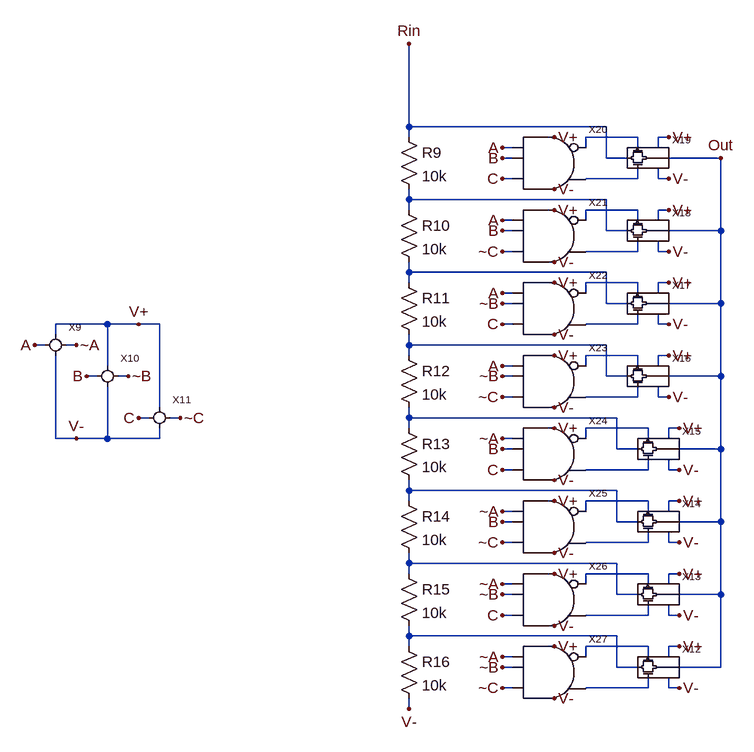
[diagram p0: schematic DAC.asc]
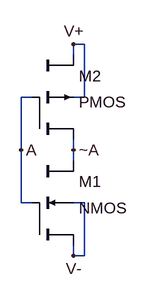
[diagram p1: sub-circuit inverter.asc]
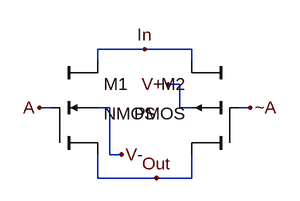
[diagram p2: sub-circuit passgate.asc]
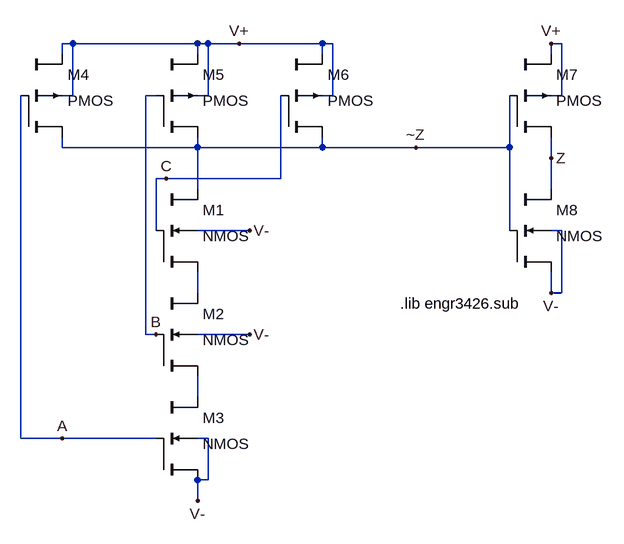
[diagram p3: sub-circuit 3-n-and.asc]
DAC.asc, the LTspice schematic file:
Version 4
SHEET 1 1852 808
WIRE 80 -832 80 -960
WIRE 384 -832 80 -832
WIRE 80 -816 80 -832
WIRE 304 -816 288 -816
WIRE 432 -816 352 -816
WIRE 480 -816 464 -816
WIRE 240 -800 224 -800
WIRE 352 -800 352 -816
WIRE 432 -800 432 -816
WIRE 464 -800 464 -816
WIRE 240 -784 224 -784
WIRE 384 -784 384 -832
WIRE 416 -784 384 -784
WIRE 560 -784 480 -784
WIRE 240 -752 224 -752
WIRE 432 -752 432 -768
WIRE 432 -752 352 -752
WIRE 464 -752 464 -768
WIRE 480 -752 464 -752
WIRE 304 -736 288 -736
WIRE 80 -720 80 -736
WIRE 384 -720 80 -720
WIRE 80 -704 80 -720
WIRE 304 -704 288 -704
WIRE 432 -704 352 -704
WIRE 480 -704 464 -704
WIRE 240 -688 224 -688
WIRE 352 -688 352 -704
WIRE 432 -688 432 -704
WIRE 464 -688 464 -704
WIRE 240 -672 224 -672
WIRE 384 -672 384 -720
WIRE 416 -672 384 -672
WIRE 560 -672 560 -784
WIRE 560 -672 480 -672
WIRE 240 -640 224 -640
WIRE 432 -640 432 -656
WIRE 432 -640 352 -640
WIRE 464 -640 464 -656
WIRE 480 -640 464 -640
WIRE 304 -624 288 -624
WIRE 80 -608 80 -624
WIRE 384 -608 80 -608
WIRE 80 -592 80 -608
WIRE 304 -592 288 -592
WIRE 432 -592 352 -592
WIRE 480 -592 464 -592
WIRE 240 -576 224 -576
WIRE 352 -576 352 -592
WIRE 432 -576 432 -592
WIRE 464 -576 464 -592
WIRE 240 -560 224 -560
WIRE 384 -560 384 -608
WIRE 416 -560 384 -560
WIRE 560 -560 560 -672
WIRE 560 -560 480 -560
WIRE -384 -528 -464 -528
WIRE -336 -528 -384 -528
WIRE -304 -528 -336 -528
WIRE 240 -528 224 -528
WIRE 432 -528 432 -544
WIRE 432 -528 352 -528
WIRE 464 -528 464 -544
WIRE 480 -528 464 -528
WIRE -464 -512 -464 -528
WIRE 304 -512 288 -512
WIRE -480 -496 -496 -496
WIRE -432 -496 -448 -496
WIRE 80 -496 80 -512
WIRE 384 -496 80 -496
WIRE 80 -480 80 -496
WIRE 304 -480 288 -480
WIRE 432 -480 352 -480
WIRE 480 -480 464 -480
WIRE -384 -464 -384 -528
WIRE 240 -464 224 -464
WIRE 352 -464 352 -480
WIRE 432 -464 432 -480
WIRE 464 -464 464 -480
WIRE -400 -448 -416 -448
WIRE -352 -448 -368 -448
WIRE 240 -448 224 -448
WIRE 384 -448 384 -496
WIRE 416 -448 384 -448
WIRE 560 -448 560 -560
WIRE 560 -448 480 -448
WIRE 240 -416 224 -416
WIRE 432 -416 432 -432
WIRE 432 -416 352 -416
WIRE 464 -416 464 -432
WIRE 480 -416 464 -416
WIRE -304 -400 -304 -528
WIRE 304 -400 288 -400
WIRE -320 -384 -336 -384
WIRE -272 -384 -288 -384
WIRE 80 -384 80 -400
WIRE 400 -384 80 -384
WIRE 80 -368 80 -384
WIRE 304 -368 288 -368
WIRE 448 -368 352 -368
WIRE 496 -368 480 -368
WIRE -464 -352 -464 -480
WIRE -432 -352 -464 -352
WIRE -384 -352 -384 -432
WIRE -384 -352 -432 -352
WIRE -304 -352 -304 -368
WIRE -304 -352 -384 -352
WIRE 240 -352 224 -352
WIRE 352 -352 352 -368
WIRE 448 -352 448 -368
WIRE 480 -352 480 -368
WIRE 240 -336 224 -336
WIRE 400 -336 400 -384
WIRE 432 -336 400 -336
WIRE 560 -336 560 -448
WIRE 560 -336 496 -336
WIRE 240 -304 224 -304
WIRE 448 -304 448 -320
WIRE 448 -304 352 -304
WIRE 480 -304 480 -320
WIRE 496 -304 480 -304
WIRE 304 -288 288 -288
WIRE 80 -272 80 -288
WIRE 400 -272 80 -272
WIRE 80 -256 80 -272
WIRE 304 -256 288 -256
WIRE 448 -256 352 -256
WIRE 496 -256 480 -256
WIRE 240 -240 224 -240
WIRE 352 -240 352 -256
WIRE 448 -240 448 -256
WIRE 480 -240 480 -256
WIRE 240 -224 224 -224
WIRE 400 -224 400 -272
WIRE 432 -224 400 -224
WIRE 560 -224 560 -336
WIRE 560 -224 496 -224
WIRE 240 -192 224 -192
WIRE 448 -192 448 -208
WIRE 448 -192 352 -192
WIRE 480 -192 480 -208
WIRE 496 -192 480 -192
WIRE 304 -176 288 -176
WIRE 80 -160 80 -176
WIRE 400 -160 80 -160
WIRE 80 -144 80 -160
WIRE 304 -144 288 -144
WIRE 448 -144 352 -144
WIRE 496 -144 480 -144
WIRE 240 -128 224 -128
WIRE 352 -128 352 -144
WIRE 448 -128 448 -144
WIRE 480 -128 480 -144
WIRE 240 -112 224 -112
WIRE 400 -112 400 -160
WIRE 432 -112 400 -112
WIRE 560 -112 560 -224
WIRE 560 -112 496 -112
WIRE 240 -80 224 -80
WIRE 448 -80 448 -96
WIRE 448 -80 352 -80
WIRE 480 -80 480 -96
WIRE 496 -80 480 -80
WIRE 304 -64 288 -64
WIRE 80 -48 80 -64
WIRE 400 -48 80 -48
WIRE 80 -32 80 -48
WIRE 304 -32 288 -32
WIRE 448 -32 352 -32
WIRE 496 -32 480 -32
WIRE 240 -16 224 -16
WIRE 352 -16 352 -32
WIRE 448 -16 448 -32
WIRE 480 -16 480 -32
WIRE 240 0 224 0
WIRE 400 0 400 -48
WIRE 432 0 400 0
WIRE 560 0 560 -112
WIRE 560 0 496 0
WIRE 240 32 224 32
WIRE 448 32 448 16
WIRE 448 32 352 32
WIRE 480 32 480 16
WIRE 496 32 480 32
WIRE 304 48 288 48
WIRE 80 64 80 48
FLAG 80 64 V-
FLAG 80 -960 Rin
FLAG 224 -800 A
FLAG 224 -688 A
FLAG 224 -576 A
FLAG 224 -464 A
FLAG 224 -352 ~A
FLAG 224 -240 ~A
FLAG 224 -128 ~A
FLAG 224 -16 ~A
FLAG 224 -784 B
FLAG 224 -672 B
FLAG 224 -336 B
FLAG 224 -224 B
FLAG 224 -560 ~B
FLAG 224 -448 ~B
FLAG 224 -112 ~B
FLAG 224 0 ~B
FLAG 224 -752 C
FLAG 224 -528 C
FLAG 224 -304 C
FLAG 224 -80 C
FLAG 224 -640 ~C
FLAG 224 -416 ~C
FLAG 224 -192 ~C
FLAG 224 32 ~C
FLAG -496 -496 A
FLAG -432 -496 ~A
FLAG -416 -448 B
FLAG -352 -448 ~B
FLAG -336 -384 C
FLAG -272 -384 ~C
FLAG -336 -528 V+
FLAG -432 -352 V-
FLAG 496 -32 V+
FLAG 496 32 V-
FLAG 496 -144 V+
FLAG 496 -80 V-
FLAG 496 -256 V+
FLAG 496 -192 V-
FLAG 496 -368 V+
FLAG 496 -304 V-
FLAG 480 -480 V+
FLAG 480 -416 V-
FLAG 480 -592 V+
FLAG 480 -528 V-
FLAG 480 -704 V+
FLAG 480 -640 V-
FLAG 480 -816 V+
FLAG 480 -752 V-
FLAG 304 -816 V+
FLAG 304 -704 V+
FLAG 304 -592 V+
FLAG 304 -480 V+
FLAG 304 -368 V+
FLAG 304 -256 V+
FLAG 304 -144 V+
FLAG 304 -32 V+
FLAG 304 48 V-
FLAG 304 -64 V-
FLAG 304 -176 V-
FLAG 304 -288 V-
FLAG 304 -400 V-
FLAG 304 -512 V-
FLAG 304 -624 V-
FLAG 304 -736 V-
FLAG 560 -784 Out
SYMBOL res 64 -832 R0
SYMATTR InstName R9
SYMATTR Value 10k
SYMBOL res 64 -720 R0
SYMATTR InstName R10
SYMATTR Value 10k
SYMBOL res 64 -608 R0
SYMATTR InstName R11
SYMATTR Value 10k
SYMBOL res 64 -496 R0
SYMATTR InstName R12
SYMATTR Value 10k
SYMBOL res 64 -384 R0
SYMATTR InstName R13
SYMATTR Value 10k
SYMBOL res 64 -272 R0
SYMATTR InstName R14
SYMATTR Value 10k
SYMBOL res 64 -160 R0
SYMATTR InstName R15
SYMATTR Value 10k
SYMBOL res 64 -48 R0
SYMATTR InstName R16
SYMATTR Value 10k
SYMBOL Inverter -464 -496 R0
SYMATTR InstName X9
SYMBOL Inverter -384 -448 R0
SYMATTR InstName X10
SYMBOL Inverter -304 -384 R0
SYMATTR InstName X11
SYMBOL PassGate 464 0 R0
SYMATTR InstName X12
SYMBOL PassGate 464 -112 R0
SYMATTR InstName X13
SYMBOL PassGate 464 -224 R0
SYMATTR InstName X14
SYMBOL PassGate 464 -336 R0
SYMATTR InstName X15
SYMBOL PassGate 448 -448 R0
SYMATTR InstName X16
SYMBOL PassGate 448 -560 R0
SYMATTR InstName X17
SYMBOL PassGate 448 -672 R0
SYMATTR InstName X18
SYMBOL PassGate 448 -784 R0
SYMATTR InstName X19
SYMBOL 3-N-AND 256 -736 R0
SYMATTR InstName X20
SYMBOL 3-N-AND 256 -624 R0
SYMATTR InstName X21
SYMBOL 3-N-AND 256 -512 R0
SYMATTR InstName X22
SYMBOL 3-N-AND 256 -400 R0
SYMATTR InstName X23
SYMBOL 3-N-AND 256 -288 R0
SYMATTR InstName X24
SYMBOL 3-N-AND 256 -176 R0
SYMATTR InstName X25
SYMBOL 3-N-AND 256 -64 R0
SYMATTR InstName X26
SYMBOL 3-N-AND 256 48 R0
SYMATTR InstName X27

inverter.asc, the sub-circuit schematic file:
Version 4
SHEET 1 880 680
WIRE 288 32 272 32
WIRE 272 48 272 32
WIRE 208 112 192 112
WIRE 288 112 288 32
WIRE 288 112 272 112
WIRE 192 192 192 112
WIRE 272 192 272 176
WIRE 272 208 272 192
WIRE 192 272 192 192
WIRE 208 272 192 272
WIRE 288 272 272 272
WIRE 272 352 272 336
WIRE 288 352 288 272
WIRE 288 352 272 352
FLAG 192 192 A
FLAG 272 192 ~A
FLAG 272 32 V+
FLAG 272 352 V-
SYMBOL cktsym\\nmos4 272 272 R0
SYMATTR InstName M1
SYMATTR Value2 l=0.6um w=1.8um
SYMBOL cktsym\\pmos4 272 112 R0
SYMATTR InstName M2
SYMATTR Value2 l=0.6um w=1.8um

passgate.asc, the sub-circuit schematic file:
Version 4
SHEET 1 880 680
WIRE 256 128 192 128
WIRE 320 128 256 128
WIRE 192 144 192 128
WIRE 320 144 320 128
WIRE 304 176 288 176
WIRE 128 208 112 208
WIRE 208 208 192 208
WIRE 304 208 304 176
WIRE 320 208 304 208
WIRE 400 208 384 208
WIRE 208 272 208 208
WIRE 224 272 208 272
WIRE 192 304 192 272
WIRE 272 304 192 304
WIRE 320 304 320 272
WIRE 320 304 272 304
FLAG 224 272 V-
FLAG 288 176 V+
FLAG 256 128 In
FLAG 272 304 Out
FLAG 112 208 A
FLAG 400 208 ~A
SYMBOL cktsym\\nmos4 192 208 R0
SYMATTR InstName M1
SYMATTR Value2 l=0.6um w=1.8um
SYMBOL cktsym\\pmos4 320 208 M0
SYMATTR InstName M2
SYMATTR Value2 l=0.6um w=1.8um

3-n-and.asc, the sub-circuit schematic file:
Version 4
SHEET 1 880 680
WIRE -128 -96 -144 -96
WIRE 64 -96 -128 -96
WIRE 80 -96 64 -96
WIRE 128 -96 80 -96
WIRE 256 -96 128 -96
WIRE 272 -96 256 -96
WIRE 624 -96 608 -96
WIRE -144 -80 -144 -96
WIRE 64 -80 64 -96
WIRE 256 -80 256 -96
WIRE 608 -80 608 -96
WIRE -128 -16 -128 -96
WIRE -128 -16 -144 -16
WIRE 0 -16 -16 -16
WIRE 80 -16 80 -96
WIRE 80 -16 64 -16
WIRE 272 -16 272 -96
WIRE 272 -16 256 -16
WIRE 624 -16 624 -96
WIRE 624 -16 608 -16
WIRE -144 64 -144 48
WIRE 64 64 64 48
WIRE 64 64 -144 64
WIRE 256 64 256 48
WIRE 256 64 64 64
WIRE 400 64 256 64
WIRE 544 64 544 -16
WIRE 544 64 400 64
WIRE 608 80 608 48
WIRE 16 112 0 112
WIRE 192 112 192 -16
WIRE 192 112 16 112
WIRE 64 128 64 64
WIRE 608 128 608 80
WIRE 0 192 0 112
WIRE 144 192 64 192
WIRE 544 192 544 64
WIRE 624 192 608 192
WIRE 64 288 64 256
WIRE 608 288 608 256
WIRE 624 288 624 192
WIRE 624 288 608 288
WIRE -16 352 -16 -16
WIRE 0 352 -16 352
WIRE 144 352 64 352
WIRE 64 448 64 416
WIRE -208 512 -208 -16
WIRE -144 512 -208 512
WIRE 0 512 -144 512
WIRE 80 512 64 512
WIRE 80 576 80 512
WIRE 80 576 64 576
WIRE 64 608 64 576
FLAG -144 512 A
FLAG 0 352 B
FLAG 16 112 C
FLAG 128 -96 V+
FLAG 144 192 V-
FLAG 144 352 V-
FLAG 64 608 V-
FLAG 608 288 V-
FLAG 608 -96 V+
FLAG 400 64 ~Z
FLAG 608 80 Z
SYMBOL cktsym\\nmos4 64 192 R0
SYMATTR InstName M1
SYMATTR Value2 l=0.6um w=1.8um
SYMBOL cktsym\\nmos4 64 352 R0
SYMATTR InstName M2
SYMATTR Value2 l=0.6um w=1.8um
SYMBOL cktsym\\nmos4 64 512 R0
SYMATTR InstName M3
SYMATTR Value2 l=0.6um w=1.8um
SYMBOL cktsym\\pmos4 -144 -16 R0
SYMATTR InstName M4
SYMATTR Value2 l=0.6um w=1.8um
SYMBOL cktsym\\pmos4 64 -16 R0
SYMATTR InstName M5
SYMATTR Value2 l=0.6um w=1.8um
SYMBOL cktsym\\pmos4 256 -16 R0
SYMATTR InstName M6
SYMATTR Value2 l=0.6um w=1.8um
SYMBOL cktsym\\pmos4 608 -16 R0
SYMATTR InstName M7
SYMATTR Value2 l=0.6um w=1.8um
SYMBOL cktsym\\nmos4 608 192 R0
SYMATTR InstName M8
SYMATTR Value2 l=0.6um w=1.8um
TEXT 376 304 Left 2 !.lib engr3426.sub

The netlist it stands for:
* DAC.asc
R9 Rin N003 10k
R10 N003 N006 10k
R11 N006 N009 10k
R12 N009 N012 10k
R13 N012 N015 10k
R14 N015 N018 10k
R15 N018 N021 10k
R16 N021 V- 10k
XX9 V+ V- A ~A inverter
XX10 V+ V- B ~B inverter
XX11 V+ V- C ~C inverter
XX12 N021 Out N022 N023 V+ V- passgate
XX13 N018 Out N019 N020 V+ V- passgate
XX14 N015 Out N016 N017 V+ V- passgate
XX15 N012 Out N013 N014 V+ V- passgate
XX16 N009 Out N010 N011 V+ V- passgate
XX17 N006 Out N007 N008 V+ V- passgate
XX18 N003 Out N004 N005 V+ V- passgate
XX19 Rin Out N001 N002 V+ V- passgate
XX20 N001 N002 A B C V- V+ 3-n-and
XX21 N004 N005 A B ~C V- V+ 3-n-and
XX22 N007 N008 A ~B C V- V+ 3-n-and
XX23 N010 N011 A ~B ~C V- V+ 3-n-and
XX24 N013 N014 ~A B C V- V+ 3-n-and
XX25 N016 N017 ~A B ~C V- V+ 3-n-and
XX26 N019 N020 ~A ~B C V- V+ 3-n-and
XX27 N022 N023 ~A ~B ~C V- V+ 3-n-and

* block symbol definitions
.subckt inverter V+ V- A ~A
M1 ~A A V- V- NMOS l=0.6um w=1.8um
M2 ~A A V+ V+ PMOS l=0.6um w=1.8um
.ends inverter

.subckt passgate In Out ~A A V+ V-
M1 In A Out V- NMOS l=0.6um w=1.8um
M2 Out ~A In V+ PMOS l=0.6um w=1.8um
.ends passgate

.subckt 3-n-and ~Z Z A B C V- V+
M1 ~Z C N001 V- NMOS l=0.6um w=1.8um
M2 N001 B N002 V- NMOS l=0.6um w=1.8um
M3 N002 A V- V- NMOS l=0.6um w=1.8um
M4 ~Z A V+ V+ PMOS l=0.6um w=1.8um
M5 ~Z B V+ V+ PMOS l=0.6um w=1.8um
M6 ~Z C V+ V+ PMOS l=0.6um w=1.8um
M7 Z ~Z V+ V+ PMOS l=0.6um w=1.8um
M8 Z ~Z V- V- NMOS l=0.6um w=1.8um
.lib engr3426.sub
.ends 3-n-and

.model NMOS NMOS
.model PMOS PMOS
.lib standard.mos
.backanno
.end